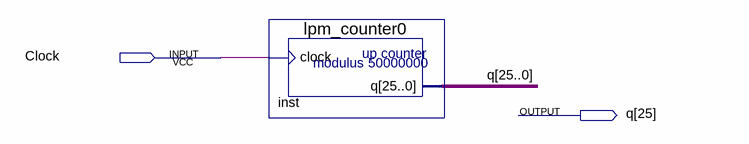
[diagram p0: schematic sheet]
// Quartus schematic divisordos.bdf as structural Verilog: 1 symbols, 2 pins
module divisordos (
  input  Clock,
  output [25:0] q
);

  lpm_counter0 inst (.clock(Clock), .q(q));
endmodule
